# Altium schematic sheet Mach1.SchDoc
size A4; SheetNumber: 1; SheetTotal: 1
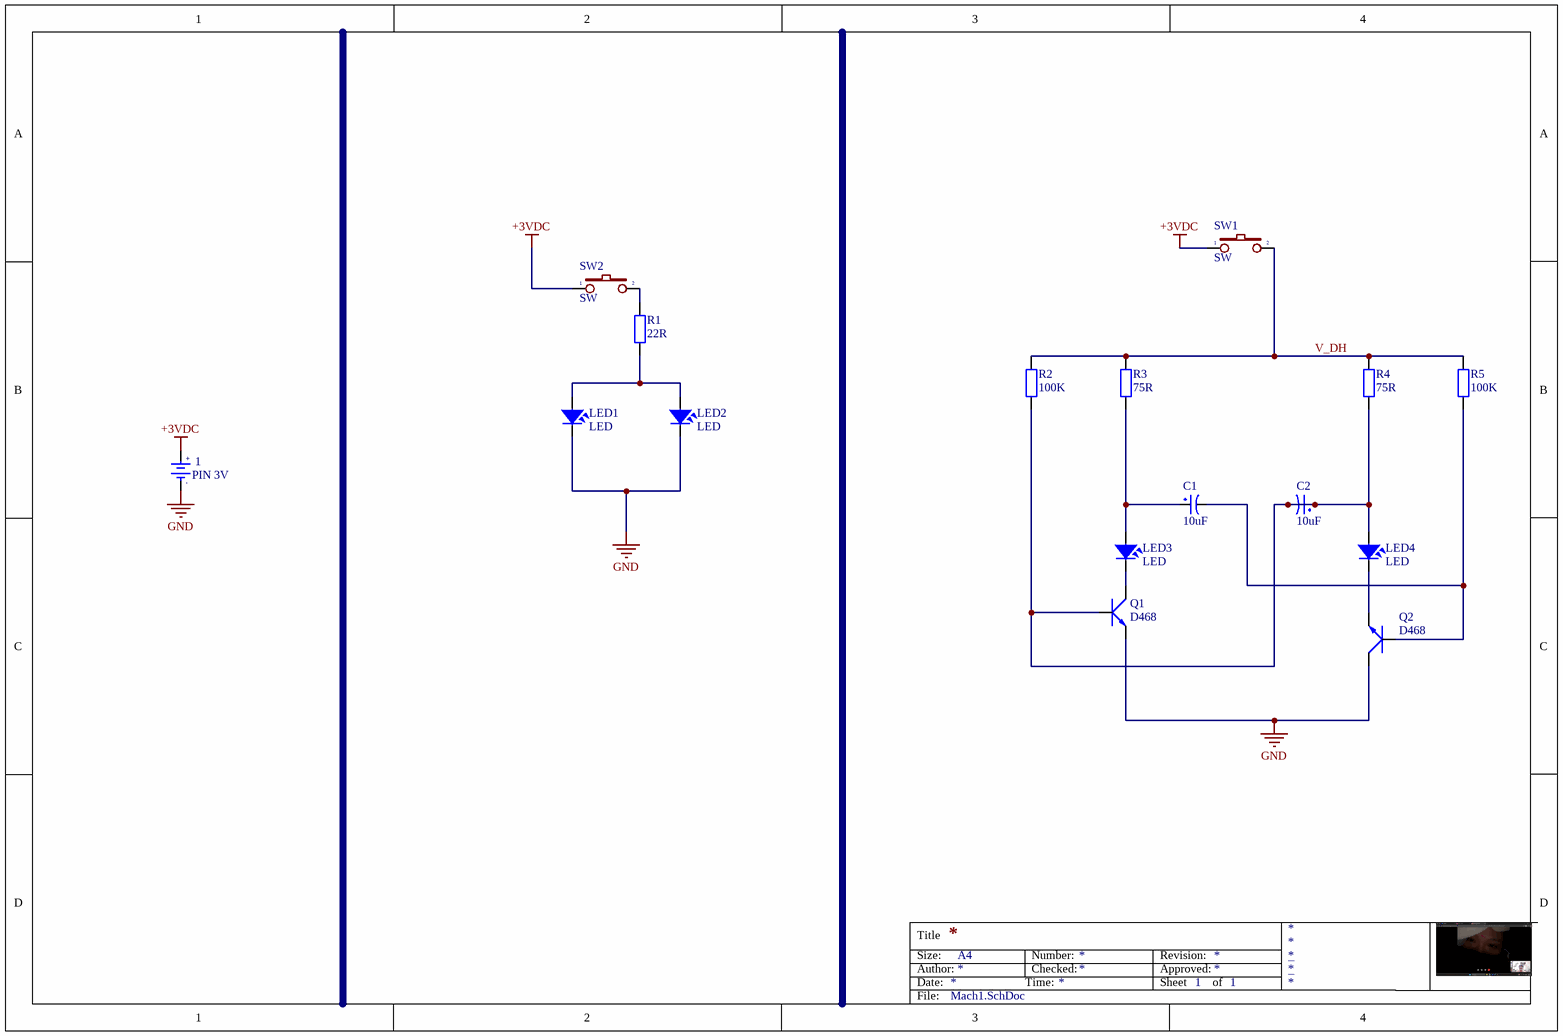
[diagram p0: Mach1.SchDoc]

## Parts
1  PIN 3V  [PIN3V]
C1  10uF  [CP1/2]
C2  10uF  [CP1/2]
LED1  LED  [LED-5 GRe]
LED2  LED  [LED-5 GRe]
LED3  LED  [LED-5 GRe]
LED4  LED  [LED-5TRED]
Q1  D468  [QTO-92]
Q2  D468  [QTO-92]
R1  22R  [RES-1/4W-SMALL]
R2  100K  [RES-1/4W-SMALL]
R3  75R  [RES-1/4W-SMALL]
R4  75R  [RES-1/4W-SMALL]
R5  100K  [RES-1/4W-SMALL]
SW1  SW  [SW2]
SW2  SW  [SW2]

## Nets
+3VDC: 1.1(+3V) SW1.1 SW2.1
GND: 1.2(GND) LED1.2 LED2.2 Q1.1(E) Q2.2(C)
V_DH: R2.2 R3.2 R4.2 R5.2 SW1.2
NetC1_1: C1.1 LED3.1 R3.1
NetC1_2: C1.2 Q2.3(B) R5.1
NetC2_1: C2.1 C2.2 LED4.1 Q1.3(B) R2.1 R4.1
NetLED1_1: LED1.1 LED2.1 R1.1
NetLED3_2: LED3.2 Q1.2(C)
NetLED4_2: LED4.2 Q2.1(E)
NetR1_2: R1.2 SW2.2

## Notes on the sheet
- Title
- Size:
- Date:
- Author:
- A4
- Time:
- Number:
- Checked:
- Revision:
- Sheet
- Approved:
- of
- File:
- (in symbol PIN 3V) +; -

## Library data of the parts
1 = PIN 3V: Battery 3VDC; Value: PIN 3V
C1 C2 = CP1: Cap P  0,1uF < 22uF , 16 - 50V; Value: 10uF/50V; Description 1: 10 => 220uF/6,3V/10V - 10uF => 100uF/16V; Description 2: 0,1uF => 33uF/50V - 10uF => 22uF/63V; Description 3: 0,47uF => 10uF/100V
LED1-LED4 = LED: LED Single colour Green and Red; Value: LED 3 ly Single Colour
Q1 Q2 = NPN_ECB: P 600mW, ECB; Value: C1815
R1-R5 = RES 1/4W: Resistor 1/4W; Value: R1/4W - 1K
SW1 SW2 = SW2: Switch button 2 pin; Value: SW chip 2 pin